# EAGLE design galvanika-board-1.0 (EAGLE 9.4.2)
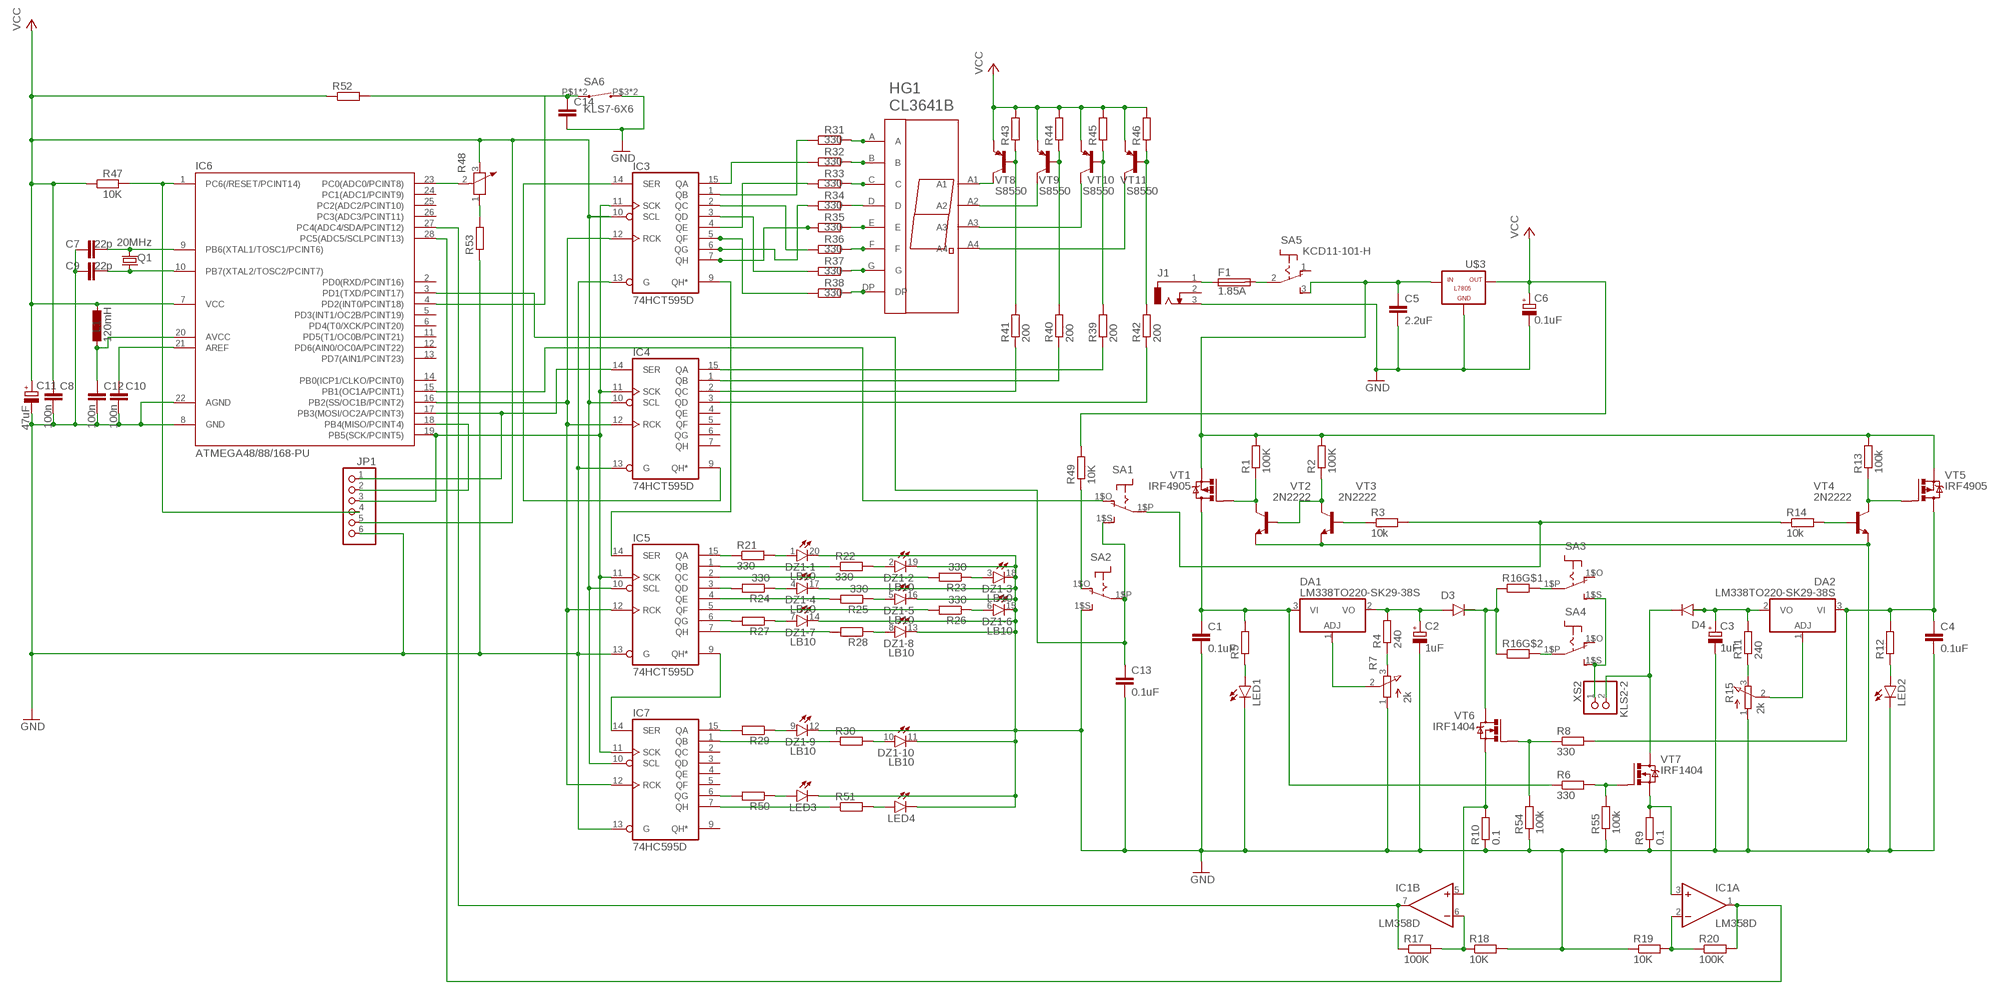
[diagram p0: schematic, sheet 1]

## Parts
C1  0.1uF  C-EUC1206  [C1206]
C2  1uF  CPOL-EUE5-4  [E5-4]
C3  1uF  CPOL-EUE5-4  [E5-4]
C4  0.1uF  C-EUC1206  [C1206]
C5  2.2uF  C-EU025-025X050  [C025-025X050]
C6  0.1uF  CPOL-EUE2.5-5  [E2,5-5]
C7  22p  C-EU025-025X050  [C025-025X050]
C8  100n  C-EU025-025X050  [C025-025X050]
C9  22p  C-EU025-025X050  [C025-025X050]
C10  100n  C-EU025-025X050  [C025-025X050]
C11  47uF  CPOL-EUE2-4  [E2-4]
C12  100n  C-EU025-025X050  [C025-025X050]
C13  0.1uF  C-EUC1206  [C1206]
C14  C-EUC1206  [C1206]
D3  1N4001  [DO41-10]
D4  1N4001  [DO41-10]
DA1  LM338TO220-SK29-38S  [TO220-SK29-38S]
DA2  LM338TO220-SK29-38S  [TO220-SK29-38S]
DZ1  LB10  [LB10]
F1  1.85A  MF-R  [MF-R]
HG1  CL3641B  [CL3641B]
IC1  LM358D  [SO08]
IC3  74HCT595D  [SO16]
IC4  74HCT595D  [SO16]
IC5  74HCT595D  [SO16]
IC6  ATMEGA48/88/168-PU  [DIL28-3]
IC7  74HC595D  [SO16]
J1  DCJ0303  [DCJ0303]
JP1  PINHD-1X6  [1X06]
L1  120mH  L-EU0207/10  [0207/10]
LED1  LED3MM  [LED3MM]
LED2  LED3MM  [LED3MM]
LED3  LED3MM  [LED3MM]
LED4  LED3MM  [LED3MM]
Q1  20MHz  CRYSTALHC49S  [HC49/S]
R1  100K  R-EU_0207/10  [0207/10]
R2  100K  R-EU_0207/10  [0207/10]
R3  10k  R-EU_0207/10  [0207/10]
R4  240  R-EU_0207/10  [0207/10]
R5  R-EU_0207/10  [0207/10]
R6  330  R-EU_0207/10  [0207/10]
R7  2k  3RP/1610N  [3RP/1610N]
R8  330  R-EU_0207/10  [0207/10]
R9  0.1  R-EU_0411/12  [0411/12]
R10  0.1  R-EU_0411/12  [0411/12]
R11  240  R-EU_0207/10  [0207/10]
R12  R-EU_0207/10  [0207/10]
R13  100k  R-EU_0207/10  [0207/10]
R14  10k  R-EU_0207/10  [0207/10]
R15  2k  3RP/1610N  [3RP/1610N]
R16  SQP-5W-2  [SQP-5W-2]
R17  100K  R-EU_R1206  [R1206]
R18  10K  R-EU_R1206  [R1206]
R19  10K  R-EU_R1206  [R1206]
R20  100K  R-EU_R1206  [R1206]
R21  330  R-EU_R1206  [R1206]
R22  330  R-EU_R1206  [R1206]
R23  330  R-EU_R1206  [R1206]
R24  330  R-EU_R1206  [R1206]
R25  330  R-EU_R1206  [R1206]
R26  330  R-EU_R1206  [R1206]
R27  R-EU_R1206  [R1206]
R28  R-EU_R1206  [R1206]
R29  R-EU_R1206  [R1206]
R30  R-EU_R1206  [R1206]
R31  330  R-EU_R1206  [R1206]
R32  330  R-EU_R1206  [R1206]
R33  330  R-EU_R1206  [R1206]
R34  330  R-EU_R1206  [R1206]
R35  330  R-EU_R1206  [R1206]
R36  330  R-EU_R1206  [R1206]
R37  330  R-EU_R1206  [R1206]
R38  330  R-EU_R1206  [R1206]
R39  200  R-EU_R1206  [R1206]
R40  200  R-EU_R1206  [R1206]
R41  200  R-EU_R1206  [R1206]
R42  200  R-EU_R1206  [R1206]
R43  R-EU_R1206  [R1206]
R44  R-EU_R1206  [R1206]
R45  R-EU_R1206  [R1206]
R46  R-EU_R1206  [R1206]
R47  10K  R-EU_0207/10  [0207/10]
R48  R0904N  [R0904N]
R49  10K  R-EU_0207/10  [0207/10]
R50  R-EU_R1206  [R1206]
R51  R-EU_R1206  [R1206]
R52  R-EU_R1206  [R1206]
R53  R-EU_R1206  [R1206]
R54  100k  R-EU_R1206  [R1206]
R55  100k  R-EU_R1206  [R1206]
SA1  SS12D00DIP  [SS12D00]
SA2  SS12D00DIP  [SS12D00]
SA3  SS12D00DIP  [SS12D00]
SA4  SS12D00DIP  [SS12D00]
SA5  KCD11-101-H  [KCD11-101-H]
SA6  KLS7-6X6  [KLS7-6X6]
U$3  L7805  [TO220-SK29-38S]
VT1  IRF4905  [TO220-V]
VT2  2N2222  [TO92]
VT3  2N2222  [TO92]
VT4  2N2222  [TO92]
VT5  IRF4905  [TO220-V]
VT6  IRF1404  [TO220-V]
VT7  IRF1404  [TO220-V]
VT8  S8550  [TO92]
VT9  S8550  [TO92]
VT10  S8550  [TO92]
VT11  S8550  [TO92]
XS2  KLS2-2  [KLS2-2]

## Nets
+19V: C5.1 R1.2 R2.2 R13.2 SA5.3(S) U$3.1(IN) VT1.S VT5.S
A-LEFT: IC1.3(A:+IN) R9.2 VT7.S
A-RIGHT: IC1.5(B:+IN) R10.2 VT6.S
BRANCH-CTRL: R3.2 R14.1 SA1.1$P(P)
CLOCK: IC3.11(SCK) IC4.11(SCK) IC5.11(SCK) IC6.19(PB5(SCK/PCINT5)) IC7.11(SCK) JP1.3
DATA: IC3.14(SER) IC4.9(QH*)
GND: C1.2 C2.- C3.- C4.2 C5.2 C6.- C7.1 C8.2 C9.1 C10.2 C11.- C12.2 C13.2 C14.2 DZ1.11(-10:C) DZ1.12(-9:C) DZ1.13(-8:C) DZ1.14(-7:C) DZ1.15(-6:C) DZ1.16(-5:C) DZ1.17(-4:C) DZ1.18(-3:C) DZ1.19(-2:C) DZ1.20(-1:C) IC3.13(G) IC4.13(G) IC5.13(G) IC6.8(GND) IC6.22(AGND) IC7.13(G) J1.3 JP1.6 LED1.K(C) LED2.K(C) LED3.K(C) LED4.K(C) R7.1(A) R9.1 R10.1 R15.1(A) R18.2 R19.1 R53.1 R54.1 R55.1 SA2.1$S(S) SA6.P$3 SA6.P$4 U$3.2(GND) VT2.3(E) VT3.3(E) VT4.3(E)
LATCH: IC3.12(RCK) IC4.12(RCK) IC5.12(RCK) IC6.16(PB2(SS/OC1B/PCINT2)) IC7.12(RCK)
MISO: IC6.18(PB4(MISO/PCINT4)) JP1.2
MOSI: IC4.14(SER) IC6.17(PB3(MOSI/OC2A/PCINT3)) JP1.1
N$1: R1.1 VT1.G VT2.1(C)
N$2: R2.1 VT2.2(B) VT3.1(C)
N$3: R16.4 SA4.1$P(P)
N$4: IC5.15(QA) R21.1
N$5: HG1.D R34.2
N$6: R3.1 VT3.2(B)
N$7: IC3.4(QE) R33.1
N$8: LED1.A R5.1
N$9: R4.1 R7.3(E)
N$10: DA1.1(ADJ) R7.2(S)
N$11: IC1.7(B:OUT) IC6.27(PC4(ADC4/SDA/PCINT12)) R17.1
N$12: R8.1 R54.2 VT6.G
N$13: D3.C(CATHODE) R16.1 R16.3 VT6.D
N$14: R16.2 SA3.1$P(P)
N$15: R6.2 R55.2 VT7.G
N$16: IC3.1(QB) R31.1
N$17: IC3.7(QH) R35.1
N$18: DZ1.1(-1:A) R21.2
N$19: LED2.A R12.1
N$20: R13.1 VT4.1(C) VT5.G
N$21: R11.1 R15.3(E)
N$22: R14.2 VT4.2(B)
N$23: DA2.1(ADJ) R15.2(S)
N$25: IC7.6(QG) R50.2
N$26: IC1.6(B:-IN) R17.2 R18.1
N$27: IC1.2(A:-IN) R19.2 R20.1
N$28: IC1.1(A:OUT) IC6.28(PC5(ADC5/SCLPCINT13)) R20.2
N$29: IC5.1(QB) R22.1
N$30: DZ1.2(-2:A) R22.2
N$31: IC5.2(QC) R23.2
N$32: DZ1.3(-3:A) R23.1
N$33: DZ1.4(-4:A) R24.1
N$34: IC5.3(QD) R24.2
N$35: IC3.5(QF) R38.1
N$36: IC5.4(QE) R25.2
N$37: DZ1.5(-5:A) R25.1
N$38: IC5.5(QF) R26.2
N$39: DZ1.6(-6:A) R26.1
N$40: IC5.6(QG) R27.2
N$41: DZ1.7(-7:A) R27.1
N$42: IC5.7(QH) R28.2
N$43: DZ1.8(-8:A) R28.1
N$44: IC3.2(QC) R36.1
N$45: IC3.9(QH*) IC5.14(SER)
N$46: IC7.7(QH) R51.1
N$47: IC5.9(QH*) IC7.14(SER)
N$48: IC7.15(QA) R29.2
N$49: IC7.1(QB) R30.1
N$50: DZ1.10(-10:A) R30.2
N$51: DZ1.9(-9:A) R29.1
N$52: HG1.A R31.2
N$53: HG1.B R32.2
N$54: HG1.C R33.2
N$55: LED3.A R50.1
N$56: HG1.E R35.2
N$57: HG1.F R36.2
N$58: HG1.G R37.2
N$59: HG1.DP R38.2
N$60: D4.C(CATHODE) VT7.D XS2.2
N$61: IC3.15(QA) R32.1
N$62: F1.1 J1.1
N$63: SA3.1$S(S) SA4.1$S(S) XS2.1
N$64: IC3.3(QD) R37.1
N$65: F1.2 SA5.2(P)
N$67: IC3.6(QG) R34.1
N$68: LED4.A R51.2
N$69: IC4.15(QA) R39.1
N$70: IC4.1(QB) R40.1
N$71: IC4.2(QC) R41.1
N$72: IC4.3(QD) R42.1
N$73: R41.2 R43.1 VT8.2(B)
N$74: R40.2 R44.1 VT9.2(B)
N$75: R39.2 R45.1 VT10.2(B)
N$76: R42.2 R46.1 VT11.2(B)
N$77: HG1.A1 VT8.1(C)
N$78: HG1.A2 VT9.1(C)
N$79: HG1.A3 VT10.1(C)
N$80: HG1.A4 VT11.1(C)
N$81: C7.2 IC6.9(PB6(XTAL1/TOSC1/PCINT6)) Q1.2
N$82: C9.2 IC6.10(PB7(XTAL2/TOSC2/PCINT7)) Q1.1
N$83: C10.1 IC6.21(AREF)
N$84: C12.1 IC6.20(AVCC) L1.2
N$85: IC6.1(PC6(/RESET/PCINT14)) JP1.4 R47.2
N$86: C14.1 IC6.4(PD2(INT0/PCINT18)) R52.2 SA6.P$1 SA6.P$2
N$87: R48.1 R53.2
N$88: IC6.23(PC0(ADC0/PCINT8)) R48.2
PWM: IC6.15(PB1(OC1A/PCINT1)) SA1.1$O(O)
PWM-CTRL: C13.1 IC6.3(PD1(TXD/PCINT17)) SA1.1$S(S) SA2.1$P(P)
RIGHT-EN: R49.1 SA2.1$O(O)
VCC: C6.+ C8.1 C11.+ IC3.10(SCL) IC4.10(SCL) IC5.10(SCL) IC6.7(VCC) IC7.10(SCL) JP1.5 L1.1 R43.2 R44.2 R45.2 R46.2 R47.1 R48.3 R49.2 R52.1 U$3.3(OUT) VT8.3(E) VT9.3(E) VT10.3(E) VT11.3(E)
VI-LEFT: C1.1 DA1.3(VI) R5.2 R6.1 VT1.D
VI-RIGHT: C4.1 DA2.3(VI) R8.2 R12.2 VT5.D
VO-LEFT: C2.+ D3.A(ANODE) DA1.2(VO) R4.2
VO-RIGHT: C3.+ D4.A(ANODE) DA2.2(VO) R11.2
Unconnected: IC4.4(QE) IC4.5(QF) IC4.6(QG) IC4.7(QH) IC6.2(PD0(RXD/PCINT16)) IC6.5(PD3(INT1/OC2B/PCINT19)) IC6.6(PD4(T0/XCK/PCINT20)) IC6.11(PD5(T1/OC0B/PCINT21)) IC6.12(PD6(AIN0/OC0A/PCINT22)) IC6.13(PD7(AIN1/PCINT23)) IC6.14(PB0(ICP1/CLKO/PCINT0)) IC6.24(PC1(ADC1/PCINT9)) IC6.25(PC2(ADC2/PCINT10)) IC6.26(PC3(ADC3/PCINT11)) IC7.2(QC) IC7.3(QD) IC7.4(QE) IC7.5(QF) IC7.9(QH*) J1.2 SA3.1$O(O) SA4.1$O(O) SA5.1(O)

## Power pins joined to a net without a drawn wire
GND: IC1.4(P:V-) IC3.8(GND) IC4.8(GND) IC5.8(GND) IC7.8(GND)
VCC: IC1.8(P:V+) IC3.16(VCC) IC4.16(VCC) IC5.16(VCC) IC7.16(VCC)

## Library data of the parts
C1 C4 C5 C7-C10 C12-C14 = rcl:C-EU: CAPACITOR, European symbol; SPICEPREFIX: C
C2 C3 C6 C11 = rcl:CPOL-EU: POLARIZED CAPACITOR, European symbol; SPICEPREFIX: C
D3 D4 = tango:1N4001: DIODE general purpose rectifier, 1 A
DA1 DA2 = dragberry:LM338
DZ1 = led:LB10: LED BLOCK 10-LED bar graph, DIL, Siemens
F1 = dragberry:MF-R
HG1 = dragberry:CL3641B
IC1 = linear:LM358: OP AMP also LM158; LM258; LM2904 Source: http://cache.national.com/ds/LM/LM158.pdf
IC3-IC5 IC7 = 74xx-eu:74*595: 8-bit SHIFT REGISTER, output latch
IC6 = atmega8:ATMEGA48/88/168-PU
J1 = con-jack:DCJ0303: DC POWER JACK Source: DCJ0303.pdf; OC_FARNELL: unknown; OC_NEWARK: unknown
JP1 = pinhead:PINHD-1X6: PIN HEADER
L1 = rcl:L-EU: INDUCTOR, European symbol; SPICEPREFIX: L
LED1-LED4 = led:LED: LED OSRAM: - CHIPLED LG R971, LG N971, LY N971, LG Q971, LY Q971, LO R971, LY R971 LH N974, LH R974 LS Q976, LO Q976, LY Q976 LO Q996 - Hyper CHIPLED LW Q18S LB Q993, LB Q99A, LB R99A - SideLED LS A670, LO A670, LY A670, LG A670, LP A670 LB A673, LV A673, LT A673, LW A673 LH A674 LY A675 LS A676, LA A676, LO A676, LY A676, LW A676 LS A679, LY A679, LG A679 - Hyper Micro SIDELED® LS Y876, LA Y876, LO Y876, LY Y876 LT Y87S - SmartLED LW L88C, LW L88S LB L89C, LB L89S, LG L890 LS L89K, LO L89K, LY L89K LS L896, LA L896, LO L896, LY L896 - TOPLED LS T670, LO T670, LY T670, LG T670, LP T670 LSG T670, LSP T670, LSY T670, LOP T670, LYG T670 LG T671, LOG T671, LSG T671 LB T673, LV T673, LT T673, LW T673 LH T674 LS T676, LA T676, LO T676, LY T676, LB T676, LH T676, LSB T676, LW T676 LB T67C, LV T67C, LT T67C, LS T67K, LO T67K, LY T67K, LW E67C LS E67B, LA E67B, LO E67B, LY E67B, LB E67C, LV E67C, LT E67C LW T67C LS T679, LY T679, LG T679 LS T770, LO T770, LY T770, LG T770, LP T770 LB T773, LV T773, LT T773, LW T773 LH T774 LS E675, LA E675, LY E675, LS T675 LS T776, LA T776, LO T776, LY T776, LB T776 LHGB T686 LT T68C, LB T68C - Hyper Mini TOPLED® LB M676 - Mini TOPLED Santana® LG M470 LS M47K, LO M47K, LY M47K Source: http://www.osram.convergy.de LUXEON: - LUMILED® LXK2-PW12-R00, LXK2-PW12-S00, LXK2-PW14-U00, LXK2-PW14-V00 LXK2-PM12-R00, LXK2-PM12-S00, LXK2-PM14-U00 LXK2-PE12-Q00, LXK2-PE12-R00, LXK2-PE12-S00, LXK2-PE14-T00, LXK2-PE14-U00 LXK2-PB12-K00, LXK2-PB12-L00, LXK2-PB12-M00, LXK2-PB14-N00, LXK2-PB14-P00, LXK2-PB14-Q00 LXK2-PR12-L00, LXK2-PR12-M00, LXK2-PR14-Q00, LXK2-PR14-R00 LXK2-PD12-Q00, LXK2-PD12-R00, LXK2-PD12-S00 LXK2-PH12-R00, LXK2-PH12-S00 LXK2-PL12-P00, LXK2-PL12-Q00, LXK2-PL12-R00 Source: www.luxeon.com KINGBRIGHT: KA-3528ASYC Source: www.kingbright.com
Q1 = crystal:CRYSTAL: CRYSTAL; OC_FARNELL: 1667008; OC_NEWARK: unknown
R1-R6 R8-R14 R17-R47 R49-R55 = rcl:R-EU_: RESISTOR, European symbol; SPICEPREFIX: R
R7 R15 = pot:3RP/1610N: 16mm Potentiometer one level Source: http://www.alphapotentiometers.net/html/16mm_pot_2.html
R16 = dragberry:SQP-5W-2
R48 = dragberry:R0904N
SA1-SA4 = dragberry:SS12D00
SA5 = dragberry:KCD11-101-H
SA6 = dragberry:KLS7-6X6
U$3 = dragberry:L7805
VT1 VT5 = dragberry:IRF4905: P-Channel HEXFET® Power MOSFET RDS(on)= 0.02 Ohm, ID = -74A Source: http://www.irf.com/product-info/datasheets/data/irf4905pbf.pdf
VT2-VT4 = dragberry:2N2222
VT6 VT7 = dragberry:IRF1404
VT8-VT11 = dragberry:S8550
XS2 = dragberry:KLS2-2

## Board
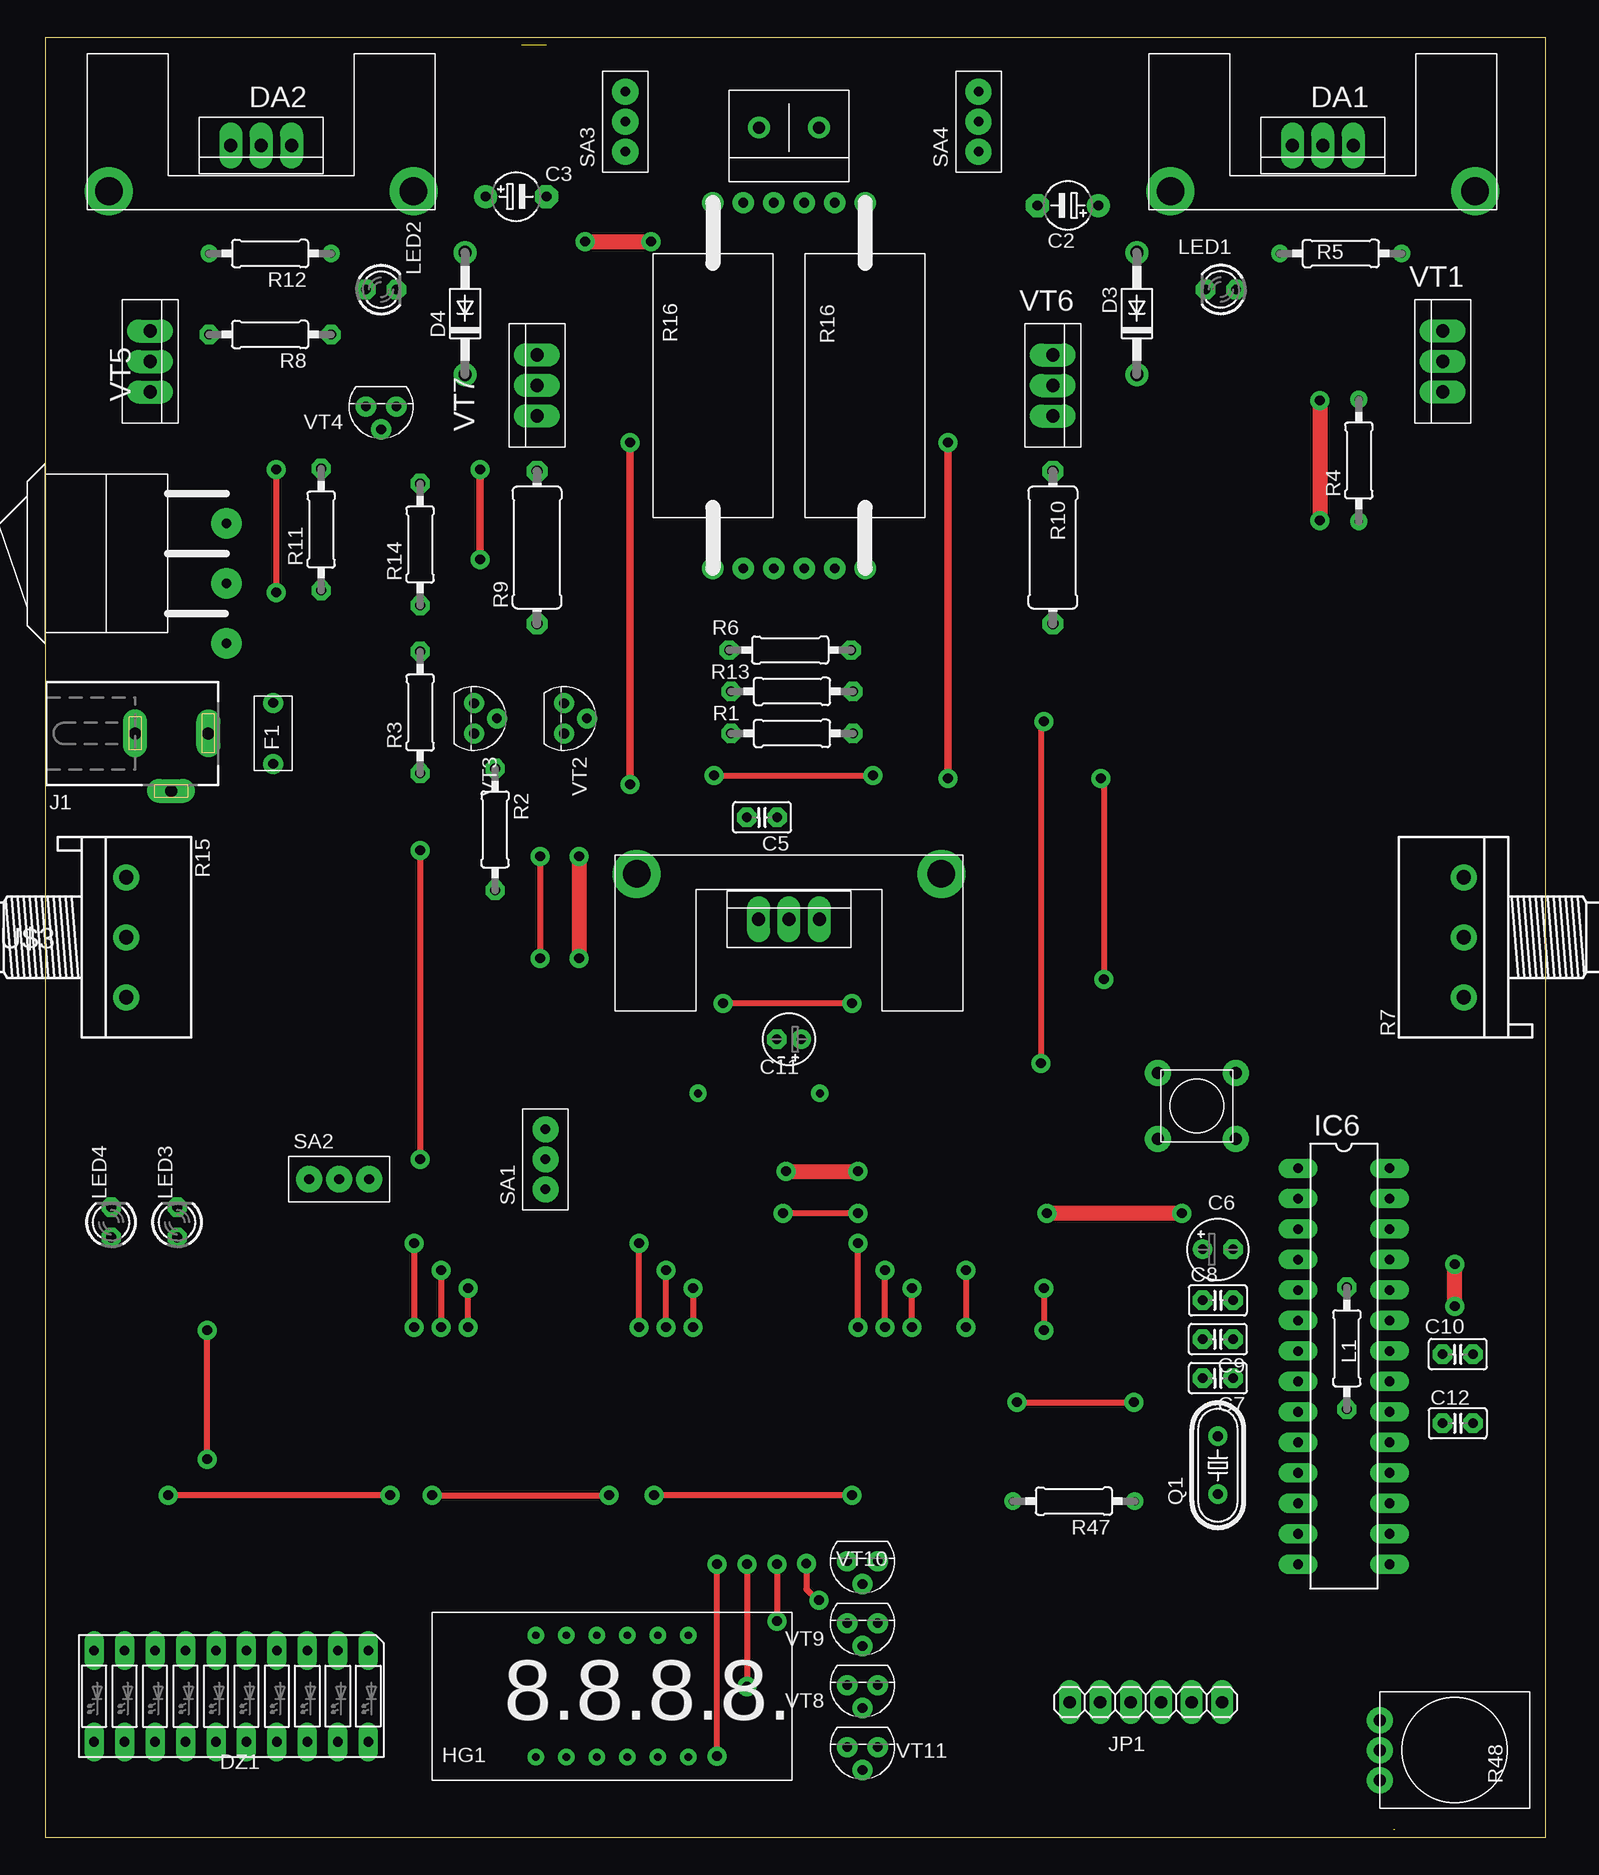
[diagram p1: board, top side]
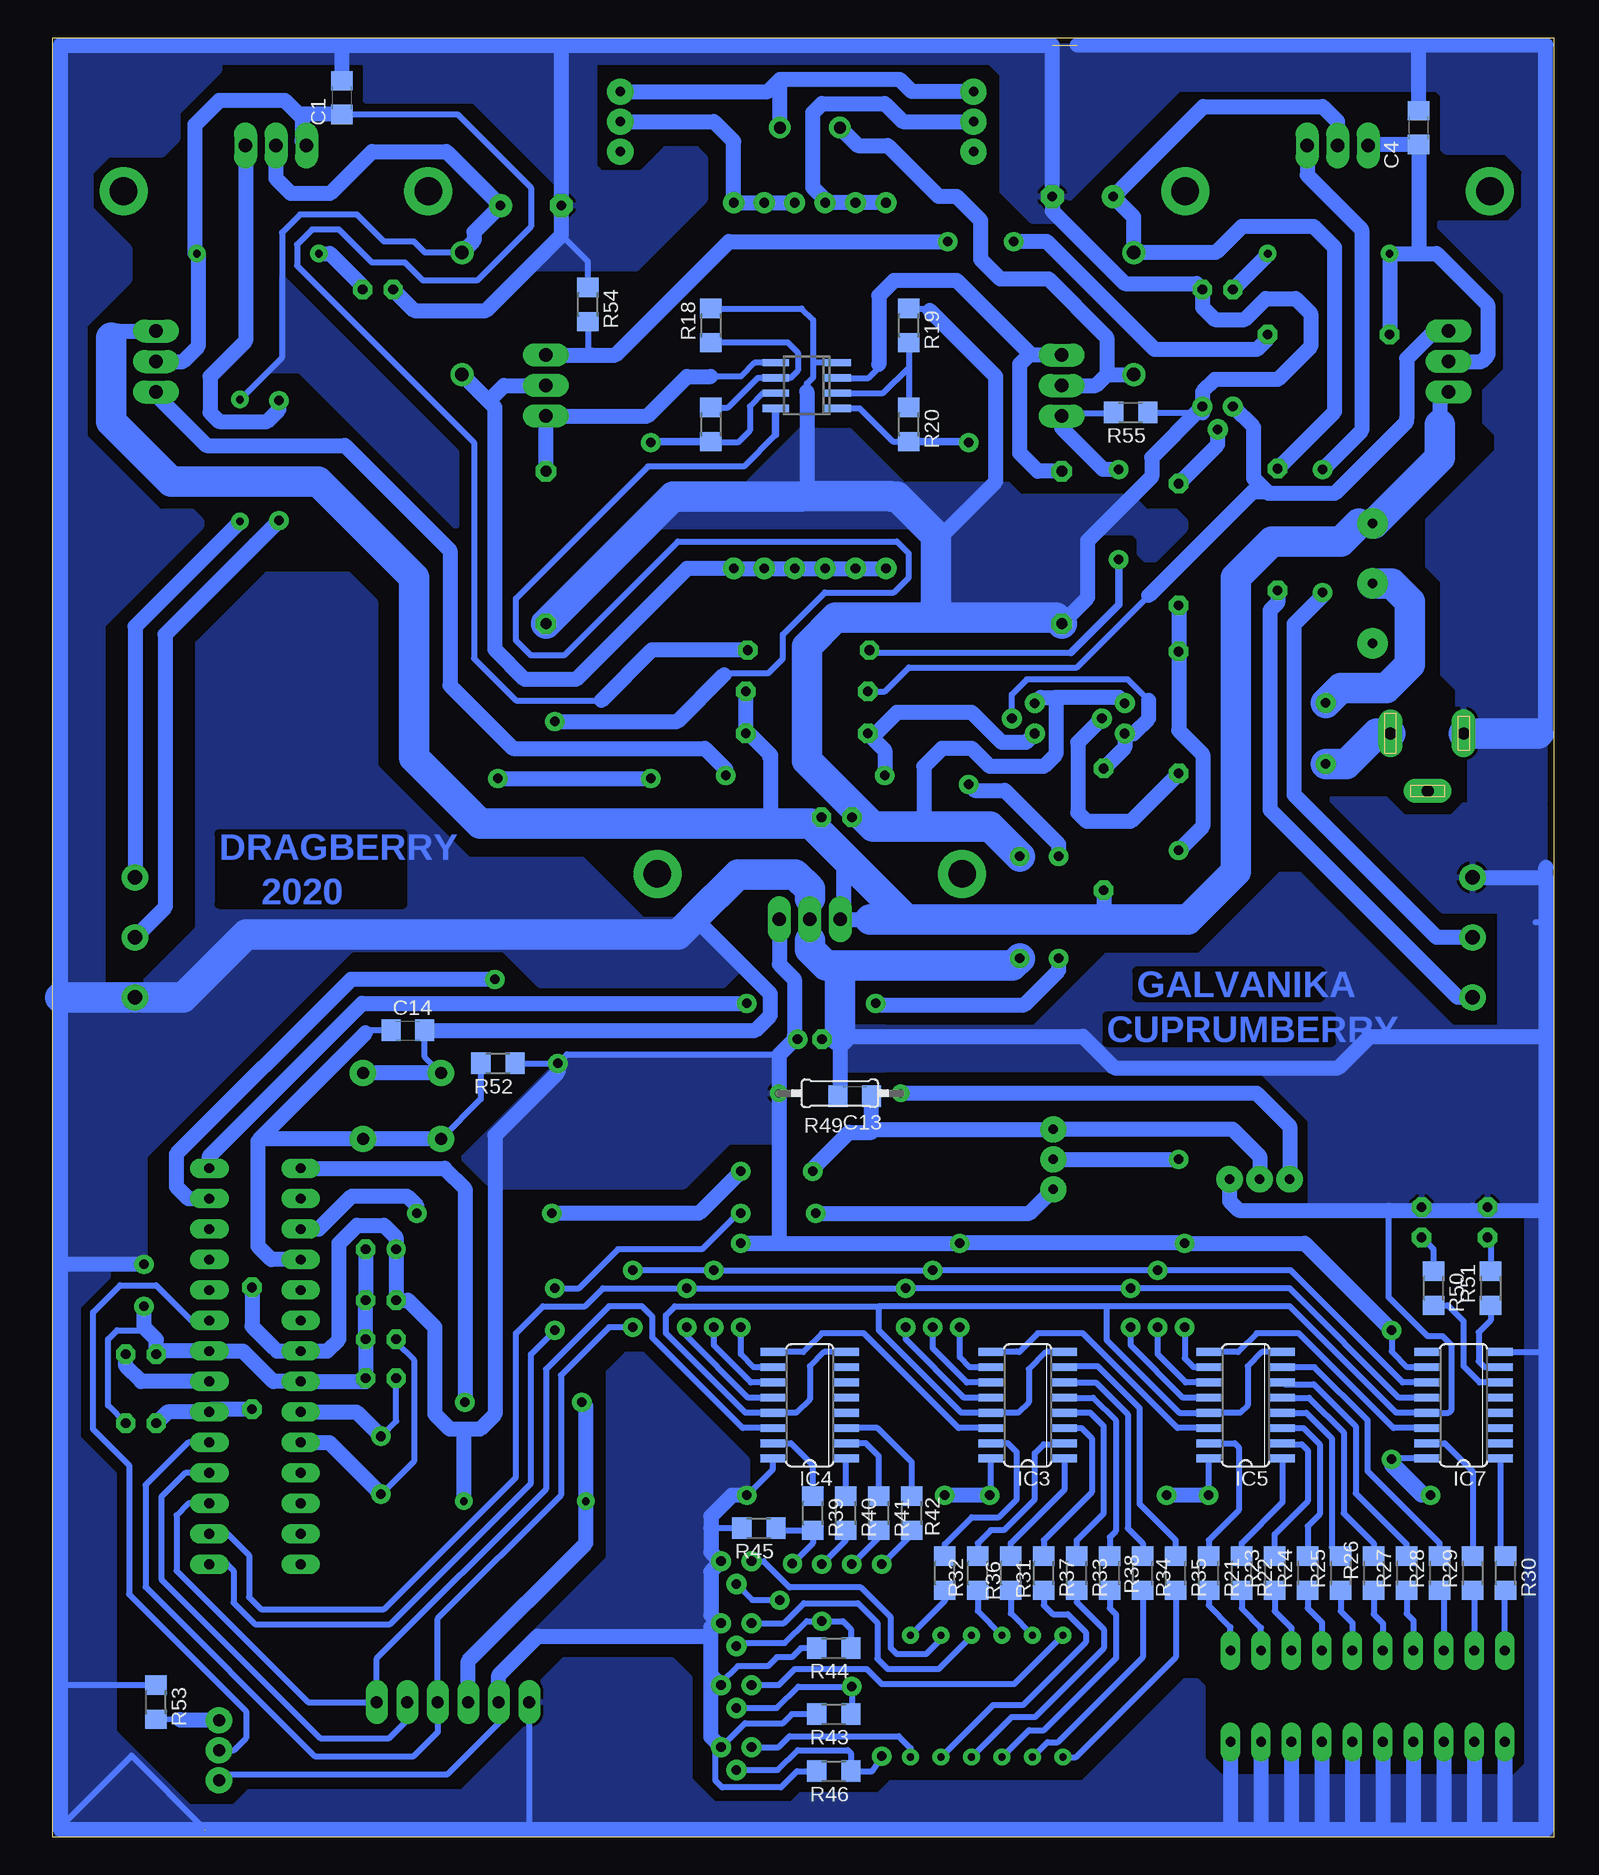
[diagram p2: board, bottom side, seen from below]

Size 125.1 x 150 mm. Coordinates in mm from the lower left corner, seen from the top.
Outline: 0,0 125.1,0 125.1,150 0,150 0,0
Copper layers (1*16): Top 0.035mm / dielectric 1.5mm / Bottom 0.035mm
Design rules "default *": minimum track width 6mil, minimum drill 0.6mm, track to track 15mil, track to pad 6mil, pad to pad 6mil, via to via 6mil, smd to smd 6mil, copper to edge 0mil, drill to drill 6mil, minimum pad ring 0.4mm, minimum via ring 8mil, stop-mask expansion 4mil, vias tented up to drill 0mil, thermal gap 10mil

### Footprints (pad centres in the part's own frame; a part is rotated, then mirrored left to right if it is on the bottom)
C1206 = smd 1.6 x 1.8: 1 -1.4,0; 2 1.4,0
E5-4 = drill 0.813 pad 1.905: + -2.54,0 | drill 0.813 pad 1.905 octagon: - 2.54,0
C025-025X050 = drill 0.813 octagon: 1 -1.27,0; 2 1.27,0
E2,5-5 = drill 0.813 pad 1.6: + -1.27,0 | drill 0.813 pad 1.6 octagon: - 1.27,0
E2-4 = drill 0.813 pad 1.27: + -1.016,0 | drill 0.813 pad 1.27 octagon: - 1.016,0
DO41-10 = drill 1.118: A 5.08,0; C -5.08,0
TO220-SK29-38S = drill 1.118 long: 1 -2.54,0; 2 0,0; 3 2.54,0 | drill 2.3 pad 4: R$1 -12.7,3.8; R$2 12.7,3.8
LB10 = drill 0.813 long: 1 -11.43,-3.81; 2 -8.89,-3.81; 3 -6.35,-3.81; 4 -3.81,-3.81; 5 -1.27,-3.81; 6 1.27,-3.81; 7 3.81,-3.81; 8 6.35,-3.81; 9 8.89,-3.81; 10 11.43,-3.81; 11 11.43,3.81; 12 8.89,3.81; 13 6.35,3.81; 14 3.81,3.81; 15 1.27,3.81; 16 -1.27,3.81; 17 -3.81,3.81; 18 -6.35,3.81; 19 -8.89,3.81; 20 -11.43,3.81
MF-R = drill 0.8 pad 1.676: 1 -2.54,0; 2 2.54,0
CL3641B = drill 0.6 pad 1.27: A -3.81,5.08; A1 -6.35,5.08; A2 1.27,5.08; A3 3.81,5.08; A4 6.35,-5.08; B 6.35,5.08; C 1.27,-5.08; D -3.81,-5.08; DP -1.27,-5.08; E -6.35,-5.08; F -1.27,5.08; G 3.81,-5.08
SO08 = smd 0.6 x 2.2: 1 -1.905,-2.6; 2 -0.635,-2.6; 3 0.635,-2.6; 4 1.905,-2.6; 5 1.905,2.6; 6 0.635,2.6; 7 -0.635,2.6; 8 -1.905,2.6
SO16 = smd 0.66 x 2.032: 1 -4.445,-3.073; 2 -3.175,-3.073; 3 -1.905,-3.073; 4 -0.635,-3.073; 5 0.635,-3.073; 6 1.905,-3.073; 7 3.175,-3.073; 8 4.445,-3.073; 9 4.445,3.073; 10 3.175,3.073; 11 1.905,3.073; 12 0.635,3.073; 13 -0.635,3.073; 14 -1.905,3.073; 15 -3.175,3.073; 16 -4.445,3.073
DIL28-3 = drill 0.813 long: 1 -16.51,-3.81; 2 -13.97,-3.81; 3 -11.43,-3.81; 4 -8.89,-3.81; 5 -6.35,-3.81; 6 -3.81,-3.81; 7 -1.27,-3.81; 8 1.27,-3.81; 9 3.81,-3.81; 10 6.35,-3.81; 11 8.89,-3.81; 12 11.43,-3.81; 13 13.97,-3.81; 14 16.51,-3.81; 15 16.51,3.81; 16 13.97,3.81; 17 11.43,3.81; 18 8.89,3.81; 19 6.35,3.81; 20 3.81,3.81; 21 1.27,3.81; 22 -1.27,3.81; 23 -3.81,3.81; 24 -6.35,3.81; 25 -8.89,3.81; 26 -11.43,3.81; 27 -13.97,3.81; 28 -16.51,3.81
DCJ0303 = drill 1 pad 2 long: 1 0,3.1; 2 4.8,0; 3 0,-3
1X06 = drill 1.016 long: 1 -6.35,0; 2 -3.81,0; 3 -1.27,0; 4 1.27,0; 5 3.81,0; 6 6.35,0
0207/10 = drill 0.813 octagon: 1 -5.08,0; 2 5.08,0
LED3MM = drill 0.813 octagon: A -1.27,0; K 1.27,0
HC49/S = drill 0.813: 1 -2.413,0; 2 2.413,0
0207/10' = drill 0.65 pad 1.27: 1 -5.08,0; 2 5.08,0
3RP/1610N = drill 1.2 pad 2.184: 1 -5,0; 2 0,0; 3 5,0
0411/12 = drill 0.914 octagon: 1 -6.35,0; 2 6.35,0
SQP-5W-2 = drill 0.8 pad 1.778: 1 -15.24,6.35; 2 15.24,6.35; 3 -15.24,-6.35; 4 15.24,-6.35; P$1 -15.24,3.81; P$2 -15.24,1.27; P$3 -15.24,-1.27; P$4 -15.24,-3.81; P$5 15.24,3.81; P$6 15.24,1.27; P$7 15.24,-1.27; P$8 15.24,-3.81
R1206 = smd 1.6 x 1.803: 1 -1.422,0; 2 1.422,0
R0904N = drill 1 pad 2.184: 1 -2.5,0; 2 0,0; 3 2.5,0
SS12D00 = drill 0.8 pad 2.184: 1$O -2.5,0; 1$P 0,0; 1$S 2.5,0
KCD11-101-H = drill 0.8 pad 2.54: 1 -7.5,-10; 2 -2.5,-10; 3 2.5,-10
KLS7-6X6 = drill 1 pad 2.184: P$1 -3.25,2.75; P$2 3.25,2.75; P$3 -3.25,-2.75; P$4 3.25,-2.75
TO220-V = drill 1.118 long: D 0,0; G -2.54,0; S 2.54,0
TO92 = drill 0.813 pad 1.676: 1 1.27,0; 2 0,1.905; 3 -1.27,0
KLS2-2 = drill 1 pad 1.778: 1 -2.5,0; 2 2.5,0

### Placement (x,y rotation side)
C1  101,145 90 bottom
C2  85.25,136 180 top
C3  39.25,136.75 0 top
C4  11.25,142.5 90 bottom
C5  59.75,85 180 top
C6  97.75,49 0 top
C7  97.75,38.25 180 top
C8  97.75,44.75 0 top
C9  97.75,41.5 180 top
C10  117.75,40.25 180 top
C11  62,66.5 180 top
C12  117.75,34.5 0 top
C13  58.25,61.75 180 bottom
C14  95.5,67.25 0 bottom
D3  91,127 90 top
D4  35,127 90 top
DA1  106.5,141 180 top
DA2  18,141 180 top
DZ1  15.5,11.75 180 top
F1  19,92 90 top
HG1  47.25,11.75 0 top
IC1  62.25,121 90 bottom
IC3  43.83,36 90 bottom
IC4  62,36 90 bottom
IC5  25.67,36 90 bottom
IC6  108.25,39.25 270 top
IC7  7.5,36 90 bottom
J1  10.5,92 270 top
JP1  91.75,11.25 180 top
L1  108.5,40.75 270 top
LED1  98,129 180 top
LED2  28,129 0 top
LED3  11,51.25 90 top
LED4  5.5,51.25 90 top
Q1  97.75,31 90 top
R1  62.25,92 0 top
R2  37.5,84 270 top
R3  31.25,93.75 90 top
R4  240  [0207/10']  109.5,114.75 90 top
R5  [0207/10']  108,132 0 top
R6  62.1,98.95 180 top
R7  118.25,75 90 top
R8  18.75,125.25 180 top
R9  41,107.5 90 top
R10  84,107.5 90 top
R11  23,109 90 top
R12  [0207/10']  18.75,132 180 top
R13  62.25,95.5 0 top
R14  31.25,107.75 90 top
R15  6.75,75 270 top
R16  62,121 90 top
R17  70.25,117.75 90 bottom
R18  70.25,126 90 bottom
R19  53.75,126 270 bottom
R20  53.75,117.75 270 bottom
R21  28.75,22 270 bottom
R22  26,22 270 bottom
R23  23.25,22 90 bottom
R24  20.5,22 90 bottom
R25  17.75,22 90 bottom
R26  15,22 90 bottom
R27  12.25,22 90 bottom
R28  9.5,22 90 bottom
R29  6.75,22 90 bottom
R30  4,22 270 bottom
R31  45.25,22 270 bottom
R32  50.75,22 270 bottom
R33  39.75,22 270 bottom
R34  34.25,22 270 bottom
R35  31.5,22 270 bottom
R36  48,22 270 bottom
R37  42.5,22 270 bottom
R38  37,22 270 bottom
R39  61.75,27 270 bottom
R40  59,27 270 bottom
R41  56.25,27 270 bottom
R42  53.5,27 270 bottom
R43  60,10.25 180 bottom
R44  60,15.75 180 bottom
R45  66.25,25.75 180 bottom
R46  60,5.5 180 bottom
R47  10K  [0207/10']  85.75,28 180 top
R48  111.25,7.25 270 top
R49  10K  [0207/10']  59.5,62 180 bottom
R50  10,45.75 270 bottom
R51  5.25,45.75 90 bottom
R52  88,64.5 180 bottom
R53  116.5,11.25 270 bottom
R54  80.5,127.75 270 bottom
R55  35.25,118.75 180 bottom
SA1  41.7,56.5 90 top
SA2  24.5,54.85 0 top
SA3  48.35,143 90 top
SA4  77.8,143 90 top
SA5  5.1,107 90 top
SA6  96,60.95 180 top
U$3  62,76.5 0 top
VT1  116.5,123 90 top
VT2  43.25,93.25 270 top
VT3  35.75,93.25 270 top
VT4  28,119.25 180 top
VT5  8.75,123 270 top
VT6  84,121 270 top
VT7  41,121 90 top
VT8  68.12,12.67 180 top
VT9  68.12,17.83 180 top
VT10  68.12,23 180 top
VT11  68.12,7.5 180 top
XS2  62,142.5 180 top

### Tracks (layer width: path | path; a pad name or v marks a point on that pad's centre or on a via)
+19V
  Bottom 0.508: R13.2 67.33,95.25 67.33,92.25 R1.2 65.33,90 | 37.5,77.25 37.5,76.5
  Bottom 0.61: C5.1 61.46,85 61.96,84.5
  Bottom 1.27: 16.25,109.5 SA5.3 | VT5.S 9.5,119.71 9.5,117.75 | 59.21,81.75 59.21,76.75 U$3.1 57,76.5 | VT1.S 119.71,125.54 120.25,125 | 65.25,84.5 65.25,89.92 | 65.33,90 65.25,89.92 | 65.25,89.92 65.25,90.17 67.33,92.25 | R1.2 67.33,95.25 | R2.2 37.5,77.25
  Bottom 2.54: 57,76.5 53.96,76.5 | 16.25,109.5 17.75,108 23.5,108 26.5,105 26.5,80.5 30.5,76.5 37.5,76.5 53.96,76.5 | 53.96,76.5 59.21,81.75 61.96,84.5 65.25,84.5 89.5,84.5 95,90 95,105 103,113 115.25,113 120.25,118 120.25,125 | 9.5,117.75 9.5,115 15,109.5 SA5.3
A-LEFT
  Bottom 0.508: IC1.3 57.12,121.64 56.25,122.5 56.25,122.75 | 49.75,129.75 43.88,123.88
  Bottom 1.27: R9.2 43,113.85 44.5,115.35 44.5,122.79 43.75,123.54 | VT7.S 43.75,123.54 | 43.75,123.54 43.75,123.75 49.75,129.75 55,129.75 56.25,128.5 56.25,122.75
A-RIGHT
  Bottom 0.508: IC1.5 66.59,122.91 67.75,121.75 70.25,121.75
  Bottom 1.27: R10.2 VT6.S 75.54,118.46 72.25,121.75 70.25,121.75
BRANCH-CTRL  (via drill 0.8 pad 1.6)
  Top 0.508: v31.25,82.25 v31.25,56.5
  Bottom 0.508: R14.1 R3.2 31.25,98.5 31.25,92.25
  Bottom 1.27: R14.1 31.25,98.5 | R3.2 31.25,92.25 29.25,90.25 29.25,84.25 v31.25,82.25 | SA1.1$P v31.25,56.5
CLOCK  (via drill 0.8 pad 1.6)
  Top 0.508: v33,47.25 v33,42.5 | v51.75,42.5 v51.75,47.25 | v70,42.5 v70,47.25 | v76.75,47.25 v76.75,42.5
  Bottom 0.508: IC7.11 12.57,37.91 21.92,47.25 v33,47.25 v51.75,47.25 v70,47.25 v76.75,47.25 | IC5.11 30.66,37.91 33,40.25 v33,42.5 33,42.75 | IC3.11 48.91,37.91 51.75,40.75 v51.75,42.5 | IC4.11 66.91,37.91 70,41 v70,42.5 | IC6.19 113.81,32.9 117.36,29.34 117.36,20.84 103.27,6.75 95.02,6.75 93.02,8.75 JP1.3 93.02,18.23 82.75,28.5 82.75,38.5 78.75,42.5 v76.75,42.5
DATA
  Bottom 0.508: IC3.14 49.59,34.09 57.5,42 61,42 62.55,40.45 IC4.9
GND  (via drill 0.8 pad 1.6)  (2 unrouted)
  Top 1.27: v44.5,81.75 v44.5,73.25 | v117.5,44.25 v117.5,47.75
  Bottom 0.508: R18.2 62.67,127.42 61.71,126.46 61.71,122.91 | IC1.4 61.71,122.91 | 62.25,111.78 62.25,120.5 62.25,121.17 61.71,121.71 61.71,122.91 | 62,111.78 62,111.75 | R19.1 52.17,127.42 | IC5.8 24.3,40.45 25.5,39.25 25.5,36 26.14,35.37 IC5.13 31.2,35.37 37.25,41.42 37.25,44.25 | IC7.8 0.64,40.45 | IC3.8 42.3,40.45 43.75,39 43.75,36.25 44.63,35.37 IC3.13 49.37,35.37 56.25,42.25 56.25,44.25 | 37.25,44.25 22,44.25 13.12,35.37 IC7.13 8.75,35.37 8.5,35.62 8.5,41 9.25,41.75 10.5,41.75 13.75,45 13.75,52.25 | 37.25,44.25 56.25,44.25 | IC4.8 60.8,40.45 62,39.25 62,36.5 63.13,35.37 IC4.13 67.36,35.37 74,42 74,43.5 73.25,44.25 56.25,44.25 | C7.1 99.02,37.98 | C12.2 120.5,35.98 120.5,41.5 119.75,42.25 117.25,42.25 116.21,41.21 116.21,40.52 | 112.39,0.64 118.54,6.79 124.5,0.83 124.5,12.67 R53.1 | JP1.6 85.4,1.03 85,0.64 | LED3.K 11.27,52.25 11.75,52.25 | LED4.K 5.77,52.25 6.75,52.25 | SA6.P$4 94.1,65.05 C14.2 | 71.65,76.6 65.29,70.25 | 0.64,76.25 1.5,76.25 | R54.1 80.5,131.33 82.71,133.54 | R55.1 33.12,118.75 33.1,118.73 29.27,118.73
  Bottom 0.61: 52,127.25 52.17,127.42 | 51.25,108.25 50.75,108.75 | C5.2 57.5,85 56.75,84.25
  Bottom 1.27: 0.64,80 0.64,76.25 0.64,66.75 | 0.64,66.75 0.64,52.25 | 0.64,52.25 0.64,40.45 0.64,0.64 4,0.64 | 4,0.64 6.5,0.64 | 6.5,0.64 9,0.64 | 9,0.64 11.69,0.64 | 14,0.64 16.77,0.64 | 16.77,0.64 19,0.64 | 19,0.64 21.75,0.64 | 21.75,0.64 24.25,0.64 | 24.25,0.64 26.75,0.64 | 26.75,0.64 85,0.64 112.39,0.64 | 112.5,0.64 124.47,0.64 124.47,47.75 | 0.64,80 0.64,80.84 | 11.5,149.37 0.64,149.37 0.64,91.75 0.89,92 1.27,92 | 11.5,149.37 39.7,149.37 | 101,149.37 124.47,149.37 124.47,70 124.47,47.75 | 101,149.37 82.71,149.37 C2.- 82.71,133.54 89,127.25 94.98,127.25 LED1.K | 86,149.37 41.79,149.37 C3.- 41.79,135.54 35.75,129.5 29.77,129.5 LED2.K 29.27,127.52 28.25,126.5 25.75,126.5 24,128.25 21.5,128.25 20.25,127 20.25,124.25 23,121.5 28.25,121.5 29.27,120.48 VT4.3 29.27,118.73 | 62,78.25 U$3.2 62,74.75 | C1.2 101,149.37 | 41,101.4 R9.1 38.83,103.33 38.83,108.08 33.5,113.4 33.5,115 29.52,118.98 | R15.1 0.64,80 | C4.2 11.25,149.12 11.5,149.37 | 51.25,101.65 59.85,101.65 | 51.25,105.9 51.25,108.25 54.75,111.75 62,111.75 62.75,111.75 62.25,112.25 62.25,120.5 | DZ1.11 4.07,0.7 4,0.64 | DZ1.12 6.61,0.74 6.5,0.64 | DZ1.13 9.15,0.79 9,0.64 | DZ1.14 11.69,0.64 | DZ1.15 14.23,0.86 14,0.64 | DZ1.16 16.77,0.64 | DZ1.17 19.31,0.94 19,0.64 | DZ1.18 21.85,0.73 21.75,0.64 | DZ1.19 24.39,0.78 24.25,0.64 | DZ1.20 26.93,0.81 26.75,0.64 | 0.64,52.25 6.75,52.25 11.75,52.25 13.75,52.25 26.25,52.25 27,53 SA2.1$S | 62,74 61.25,73.25 | 99.02,37.98 IC6.8 106.73,37.98 109.27,40.52 IC6.22 116.21,40.52 C10.2 116.48,41.48 117.25,42.25 117.5,42.5 v117.5,44.25 | 59.49,66.75 59.49,73.25 61.25,73.25 | 59.49,66.75 59.49,61.91 C13.2 | C6.- C8.2 C9.1 C7.1
  Bottom 1.27: C11.- 59.74,66.5 59.49,66.75 | v117.5,47.75 124.47,47.75 | 14,0.64 11.69,0.64 | 59.49,66.75 39.21,66.75 36.6,64.13 17.95,64.13 15.33,66.75 0.64,66.75 | 50.75,108.75 46.5,113 46.5,121.75 52,127.25 | SA6.P$4 SA6.P$3 | C14.2 66.54,67.25 65.29,68.5 65.29,70.25 65.29,70.29 72,77 72,76.96 71.65,76.6 | VT3.3 36.23,95 41.5,95 | 41.5,95 42.77,95 VT2.3 | 41.5,95 41.5,90.25 42.5,89.25 47,89.25 48.5,90.75 51,90.75 52.5,89.25 52.5,84.25 | 60.66,72.66 61.25,73.25
  Bottom 2.54: J1.3 1.27,92 | 124.47,70 R7.1 114.25,70 109,75.25 73,75.25 71.88,76.38 | 71.65,76.6 68,80.25 63.21,80.25 62,79.04 62,78.25 | v44.5,73.25 45.09,72.66 59.49,72.66 | 59.49,72.66 59.49,66.75 | v44.5,81.75 47,84.25 52.5,84.25 56.75,84.25 62.25,89.75 62.25,99.25 59.85,101.65 51.61,101.65 51.47,101.79 51.47,108.47 54.75,111.75 55.24,111.75 55.26,111.78 62,111.78 62.25,111.78 | 51.25,101.65 41.5,101.65 R9.1 | 62.75,111.75 73.4,111.75 R10.1 | 59.49,72.66 60.66,72.66 62,74 62,74.75
  pour Bottom: 0.75,52 20.25,52 20.25,59.75 24.5,64 57.75,64 57.75,65.5 55.75,67.5 43.25,67.5 37.25,73.5 29.5,73.5 22.75,80.25 21.25,80.25 8.5,67.5 0.75,67.5
  pour Bottom: 0.75,86 7.5,86 8.5,85 12.5,85 14,86.5 18.5,86.5 9.25,77.25 0.75,77.25
  pour Bottom: 0.75,149.25 125,149.25 123.75,148 47,148 46,147 46,137.25 43.5,134.75 41.5,134.75 41.5,135.5 31.25,145.75 9.75,145.75 9.25,145.25 9.25,140.75 9,140.5 4,140.5 2.25,138.75 0.75,138.75
  pour Bottom: 0.25,138.75 2.25,138.75 2.5,138.5 2.5,135.75 3.75,134.5 9.5,134.5 9.5,134.25 4,128.75 4,122.25 5.75,120.5 5.75,118 4.75,117 4.75,115.5 10.5,109.75 10.5,106 9.25,104.75 9.25,97 8,95.75 8,92.5 7,91.5 7,86.25 0.75,86.25 0.75,138.25
  pour Bottom: 0.25,67.5 2.25,67.5 2.25,6 3.25,5 27.75,5 29.25,6.5 29.25,12.5 29.75,13 30.75,13 39.25,4.5 55.25,4.5 58.5,1.25 58.5,0.25 0.25,0.25
  pour Bottom: 56.5,3.5 62.75,3.5 63.5,2.75 70,2.75 72,4.75 72,13.25 73.5,14.75 82.5,14.75 85.5,11.75 85.5,9.25 91.25,3.5 91.25,0.25 59.75,0.25
  pour Bottom: 91.25,3.75 108.75,3.75 110,2.5 113.75,2.5 120,8.75 120,30.25 123,33.25 123,44.25 120.5,46.75 120.5,47.75 124.75,47.75 124.75,0.25 91.25,0.25
  pour Bottom: 111.25,149.75 111.25,147.25 114.75,143.75 114.75,141.5 116,140.25 120.5,140.25 122,138.75 122,135.75 118.75,132.5 118.75,129.75 122.5,126 122.5,116.75 116.25,110.5 113.5,110.5 112.75,109.75 112.75,109.25 121,101 121,70 124.75,70 124.75,149.75
  pour Bottom: 117.5,47.75 124.75,47.75 124.75,70 118.75,70 113,75.75 113,99.5 107.25,105.25 100.5,105.25 98.25,103 98.25,89.25 90.5,81.5 81,81.5 76,76.5 71.75,76.5 67.75,72.5 69.25,71 84.5,71 87.5,74 100.25,74 117.5,56.75
  pour Bottom: 80,149.75 80,139.25 79.5,138.75 76,138.75 74,140.75 71.5,140.75 70.75,140 70.75,136.5 76.5,130.75 86,130.75 83,133.75 83,137.75 90,144.75 99,144.75 99,149.75
  pour Bottom: 55.75,67.5 59.75,67.5 59.75,64 55.75,64
  pour Bottom: 0.25,77.5 4.5,77.5 4.5,67.75 0.25,67.75
  pour Bottom: 40.75,101.5 51.5,101.5 51.5,108.5 54.5,111.5 54.5,112.5 54.25,112.75 46,112.75 45.5,112.75 44.75,112 44.5,111.75 35.25,111.75 34,110.5 32,110.5 31.5,110.5 30.75,109.75 30.75,109 31.25,108.5 33.25,106.5 34,106.5 34.5,107 34.5,108.25 35,108.75 38.25,108.75 38.75,108.25 38.75,108 39,107.75 39,103.25
  pour Bottom: 53.25,109.25 75.5,109.25 72,112.75 67.25,112.75 62.75,117.25 58.75,117.25 53.25,111.75
LATCH  (via drill 0.8 pad 1.6)
  Top 0.508: v35.25,42.5 v35.25,45.75 | v54,42.5 v54,45.75 | v72.25,42.5 v72.25,45.75
  Bottom 0.508: IC7.12 12.88,36.63 22,45.75 v35.25,45.75 v54,45.75 v72.25,45.75 79.25,45.75 80.75,44.25 84.25,44.25 86.5,42 86.5,30 97.5,19 107.75,19 108.75,20 108.75,23.5 110.5,25.25 112.03,25.25 IC6.16 | IC5.12 30.89,36.63 35.25,41 v35.25,42.5 35.25,42.75 | IC3.12 49.13,36.63 54,41.5 v54,42.5 | IC4.12 67.14,36.63 72.25,41.75 v72.25,42.5
MISO
  Bottom 0.508: IC6.18 114.06,30.36 116.06,28.36 116.06,21.5 102.81,8.25 97.06,8.25 95.56,9.75 JP1.2
MOSI
  Bottom 0.508: IC4.14 67.59,34.09 75.12,41.62 75.12,43.38 76,44.25 78.75,44.25 84,39 84,29 98.1,14.9 JP1.1 103.83,11.25 114.79,22.21 114.79,26.84 113.81,27.82 IC6.17
N$1  (via drill 0.8 pad 1.6)
  Top 0.508: v55.75,88.5 v69,88.5
  Bottom 0.508: R1.1 56.5,92
  Bottom 1.27: VT1.G 116.5,120.21 112.29,116 100.75,116 92,107.25 92,96 86.75,90.75 70.75,90.75 69,89 v69,88.5 | VT2.1 43.98,91.25 46,91.25 48.5,93.75 54.75,93.75 56.5,92 | R1.1 55.75,90.58 v55.75,88.5
N$2
  Bottom 0.508: 33.75,94.75 35.5,96.5 43.91,96.5 45.16,95.25 VT2.2
  Bottom 1.27: R2.1 35.75,90.83 VT3.1 35.02,91.98 33.75,93.25 33.75,94.75
N$3
  Bottom 1.27: 63.24,136.24 R16.4 68.35,141.35 70,143 SA4.1$P
N$4
  Bottom 0.508: IC5.15 26.57,32.83 26.25,32.5 26.25,27.25 28.75,24.75 R21.1
N$5
  Bottom 0.508: R34.2 34.25,15 41.33,7.92 42.19,7.92 HG1.D
N$6
  Bottom 1.27: R3.1 35.25,84.67 38.92,84.67 39.66,85.41 39.66,91.25 VT3.2
N$7
  Bottom 0.508: R33.1 39.75,24.75 37.5,27 37.5,34.25 38.62,35.37 IC3.4
N$8
  Bottom 1.27: R5.1 102,132 99.27,129.27 LED1.A
N$9
  Bottom 1.27: R4.1 118.25,100.92 R7.3
N$10  (via drill 0.8 pad 1.6)
  Top 1.27: v106.25,119.75 v106.25,109.75
  Bottom 1.27: DA1.1 109.04,124.71 112,121.75 112,118.75 111.25,118 107.25,118 106.25,119 v106.25,119.75 | v106.25,109.75 115.75,100.25 115.75,77.5 R7.2
N$11  (via drill 0.8 pad 1.6)
  Top 0.508: v88,88.25 88.25,88 v88.25,71.5
  Top 0.61: v75.25,116.25 v75.25,88.25
  Bottom 0.508: IC1.7 65.89,120.36 67,119.25 67,117.25 68,116.25 70.17,116.25 R17.1
  Bottom 0.61: v75.25,116.25 75.17,116.33 R17.1
  Bottom 1.27: v88,88.25 v75.25,88.25 | v88.25,71.5 100.25,71.5 114.81,56.94 114.81,54.22 113.81,53.22 IC6.27
N$12  (via drill 0.8 pad 1.6)
  Top 1.27: v45,133 v50.5,133
  Bottom 0.508: R54.2 80.5,123.79 80.25,123.54
  Bottom 1.27: VT6.G 80.25,123.54 78.21,123.54 68.75,133 v50.5,133 | R8.1 23.83,124.92 24.75,124 33.25,124 42.25,133 v45,133
N$13
  Bottom 1.27: 88.79,119.71 D3.C 89.54,120.46 | 88.79,119.71 88.25,119.17 88.25,99 85.76,96.51 81.49,96.51 72.24,105.76 R16.3 R16.1 | 88.79,119.71 87.5,121 VT6.D
N$14
  Bottom 1.27: R16.2 60.5,136.25 61.75,137.5 61.75,143.75 61,144.5 55.75,144.5 54.25,143 SA3.1$P
N$15  (via drill 0.8 pad 1.6)
  Top 0.61: v36.25,114 v36.25,106.5
  Bottom 0.508: R6.2 56.82,98.75 40.25,98.75 | 39.71,118.46 VT7.G 40.75,118.71 36.71,118.71 R55.2
  Bottom 0.61: 40.25,98.75 36.25,102.75 v36.25,106.5
  Bottom 1.27: VT7.G 41,117.46 37.54,114 v36.25,114
N$16
  Bottom 0.508: R31.1 45.25,24.5 40.75,29 IC3.1
N$17
  Bottom 0.508: R35.1 31.5,24.75 34.5,27.75 34.5,35.75 38,39.25 40.69,39.25 IC3.7
N$18
  Bottom 0.508: R21.2 28.75,19.33 26.93,17.51 DZ1.1 | DZ1.1
N$19
  Bottom 1.27: LED2.A 23.83,131.9 R12.1
N$20
  Bottom 0.508: 23.88,112.12 24.5,112.75 | 24.5,112.75 25,113.25 | 12.25,118.25 12.25,118 | R13.1 55.75,95.5 53.75,97.5 39.75,97.5 33.75,103.5 24.5,112.75
  Bottom 1.27: VT5.G 9.96,125.54 12.25,123.25 12.25,118.25 | 12.25,118 18.25,112 23.75,112 23.88,112.12 | 23.88,112.12 25,113.25 25,117.52 VT4.1 | 23.88,112.12 25.12,112.12 33.75,103.5
N$21
  Bottom 1.27: R11.1 23,102.91 23.65,102.26 23.65,85.65 8,70 R15.3
N$22
  Bottom 1.27: R14.2 28,116.08 VT4.2
N$23  (via drill 0.8 pad 1.6)
  Top 0.508: v19.25,114 v19.25,103.75
  Bottom 0.508: 19.25,103.5 v19.25,103.75
  Bottom 1.27: R15.2 9.75,75 21.62,86.88 21.62,101.12 19.25,103.5 | v19.25,114 16,117.25 16,134 20.54,138.54 DA2.1
N$25
  Bottom 0.508: IC7.6 6.16,37.91 7.5,39.25 7.5,43 8.83,44.33 R50.2
N$26
  Bottom 0.508: R17.2 68.81,119.17 66.35,121.64 IC1.6 63.62,121.64 63,122.25 63,123.75 63.83,124.58 R18.1
N$27
  Bottom 0.508: R19.2 53.75,122.5 | 53.75,122.5 R20.1 | IC1.2 55.88,120.36 53.75,122.5
N$28  (via drill 0.8 pad 1.6)
  Top 0.508: v41.25,81.75 v41.25,73.25 | v67.25,69.5 v56.5,69.5
  Top 0.61: v48.75,116.25 v48.75,87.75
  Bottom 0.508: IC1.1 57.84,119.09 55.08,116.33 R20.2
  Bottom 0.61: R20.2 48.83,116.33 v48.75,116.25
  Bottom 1.27: v41.25,81.75 41.25,82.75 45.75,87.25 48.25,87.25 v48.75,87.75 | v56.5,69.5 56.38,69.38 44.12,69.38 41.25,72.25 v41.25,73.25 | IC6.28 112.06,56.76 99.32,69.5 v67.25,69.5
N$29
  Bottom 0.508: R22.1 26,24.5 22.59,27.91 IC5.1
N$30
  Bottom 0.508: DZ1.2 24.39,17.47 26,19.08 R22.2
N$31
  Bottom 0.508: IC5.2 22.52,32.75 21,32.75 20.5,32.25 20.5,28 23.25,25.25 R23.2
N$32
  Bottom 0.508: R23.1 23.25,18.83 21.85,17.43 DZ1.3
N$33
  Bottom 0.508: R24.1 20.5,19.08 19.31,17.89 DZ1.4
N$34
  Bottom 0.508: IC5.3 20.84,34.09 19.5,32.75 19.5,26.92 20.5,25.92 R24.2
N$35
  Bottom 0.508: IC3.5 38.38,36.63 36.5,34.75 36.5,25.5 37,25 R38.1
N$36
  Bottom 0.508: IC5.4 20.61,35.37 18.5,33.25 18.5,24.17 R25.2
N$37
  Bottom 0.508: R25.1 17.75,18.83 16.77,17.85 DZ1.5
N$38
  Bottom 0.508: IC5.5 20.39,36.63 17.5,33.75 17.5,27 15,24.5 R26.2 15,23
N$39
  Bottom 0.508: R26.1 15,18.58 14.23,17.81 DZ1.6
N$40
  Bottom 0.508: IC5.6 22.44,37.75 20,37.75 16.5,34.25 16.5,28.67 12.25,24.42 R27.2
N$41
  Bottom 0.508: R27.1 12.25,18.62 11.69,18.06 DZ1.7
N$42
  Bottom 0.508: R28.2 9.5,24.5 15.5,30.5 15.5,34.75 19.93,39.17 IC5.7
N$43
  Bottom 0.508: R28.1 9.15,20.23 DZ1.8
N$44
  Bottom 0.508: R36.1 48,24.5 46.91,25.59 45.84,25.59 43.25,28.17 43.25,32 42.5,32.75 40.84,32.75 IC3.2
N$45
  Bottom 0.508: IC5.14 31.34,34.09 39.25,42 43,42 44.5,40.5 | 44.75,40.5 44.5,40.5 | 44.5,40.5 44.55,40.45 IC3.9
N$46
  Bottom 0.508: IC7.7 5.75,39.17 6.25,39.67 6.25,42.08 5.25,43.08 R51.1
N$47
  Bottom 0.508: IC7.14 13.35,34.09 21.25,42 24.75,42 26.3,40.45 IC5.9
N$48
  Bottom 0.508: IC7.15 9.07,32.83 6.75,30.5 R29.2
N$49
  Bottom 0.508: IC7.1 4.43,23.85 R30.1
N$50
  Bottom 0.508: DZ1.10 4.07,20.56 4.05,20.58 R30.2
N$51
  Bottom 0.508: R29.1 6.61,20.44 DZ1.9
N$52
  Bottom 0.508: HG1.A 45.25,18.64 R31.2
N$53
  Bottom 0.508: R32.2 50.75,19.68 HG1.B
N$54
  Bottom 0.508: R33.2 39.75,19.58 37.5,17.33 37.5,15.75 43.25,10 45.19,10 HG1.C
N$55
  Bottom 0.508: R50.1 10,48.98 LED3.A
N$56
  Bottom 0.508: R35.2 31.5,15 39.83,6.67 HG1.E
N$57
  Bottom 0.508: R36.2 48,18.85 HG1.F
N$58
  Bottom 0.508: R37.2 42.5,19.33 41.75,18.58 40.5,18.58 39,17.08 39,16.25 44.25,11 46.73,11 HG1.G
N$59
  Bottom 0.508: R38.2 37,19.08 36.48,18.56 36.48,14.92 42.48,8.92 43.73,8.92 HG1.DP
N$60
  Bottom 1.27: XS2.2 58,141 55.5,141 51.25,136.75 49.75,136.75 47.75,134.75 47.75,131.5 46.12,129.88 42.09,129.88 39.79,127.58 39.83,127.58 37.25,125 37.25,121.92 | 41,121.04 VT7.D 38.17,121 37.25,121.92 | 37.25,121.92 D4.C
N$61
  Bottom 0.508: R32.1 50.75,24.42 48.5,26.67 46.25,26.67 44.75,28.17 44.75,32.08 45.5,32.83 IC3.15
N$62
  Bottom 2.54: F1.1 17.29,89.46 14.75,92 J1.1
N$63
  Bottom 1.27: 64.5,146.5 65.5,145.5 SA4.1$S | 64.5,146.5 54.5,146.5 53.5,145.5 SA3.1$S | XS2.1 64.5,146.5
N$64
  Bottom 0.508: IC3.3 39.34,34.09 38.5,33.25 38.5,28.75 42.5,24.75 R37.1
N$65
  Bottom 2.54: F1.2 17.75,95.79 13.96,95.79 12,97.75 12,103 13.5,104.5 SA5.2
N$67
  Bottom 0.508: IC3.6 38.16,37.91 35.5,35.25 35.5,25.75 34.25,24.5 R34.1
N$68
  Bottom 0.508: LED4.A 5.25,49.73 R51.2
N$69
  Bottom 0.508: IC4.15 63.58,32.83 61.75,31 R39.1
N$70
  Bottom 0.508: R40.1 59,31.48 IC4.1
N$71
  Bottom 0.508: R41.1 56.25,31.75 57.33,32.83 IC4.2
N$72
  Bottom 0.508: R42.1 53.5,31.25 56.34,34.09 IC4.3
N$73  (via drill 0.8 pad 1.6)
  Top 0.508: v58.5,22.75 v58.5,12.54
  Bottom 0.508: v58.5,22.75 56.25,25 R41.2 | R43.1 58.5,10.33 v58.5,12.54 62.96,12.54 64.74,10.76 VT8.2
N$74  (via drill 0.8 pad 1.6)
  Top 0.508: v61,22.75 v61,18
  Bottom 0.508: VT9.2 67.88,16.18 64.07,16.18 62.25,18 v61,18 59.25,18 58.58,17.33 R44.1 | R40.2 59,24.75 v61,22.75
N$75  (via drill 0.8 pad 1.6)
  Top 0.508: v63.45,22.8 63.45,20.68 64.38,19.75 v64.5,19.75
  Bottom 0.508: R45.1 64.66,25.58 R39.2 61.75,24.5 v63.45,22.8 | VT10.2 66.78,19.75 v64.5,19.75
N$76  (via drill 0.8 pad 1.6)
  Top 0.508: v56,6.75 v56,22.75
  Bottom 0.508: VT11.2 64.66,5.59 63,7.25 58.83,7.25 58.58,7 R46.1 56.78,5.5 56,6.71 v56,6.75 | v56,22.75 53.5,25.25 R42.2
N$77
  Bottom 0.508: HG1.A1 44.98,12.75 56,12.75 57.25,14 63.27,14 64.61,12.67 VT8.1
N$78
  Bottom 0.508: HG1.A2 48.52,16.75 51.27,14 55.5,14 56.38,14.88 56.38,17.88 58,19.5 62.5,19.5 64.17,17.83 VT9.1
N$79
  Bottom 0.508: VT10.1 65.86,23 63.68,20.82 57.75,20.82 55.25,18.32 55.25,15.75 54.75,15.25 52.31,15.25 51.06,16.5 HG1.A3
N$80
  Bottom 0.508: VT11.1 64.61,7.5 63.69,8.42 54.6,8.42 53.6,7.42 HG1.A4
N$81
  Bottom 0.508: Q1.2 96.48,34.68 C7.2
  Bottom 1.27: IC6.9 99.78,35.44 Q1.2
N$82
  Bottom 0.508: C9.2 96.48,41.25 95,39.77 95,31.34 Q1.1
  Bottom 1.27: IC6.10 102.06,32.9 Q1.1
N$83
  Bottom 1.27: IC6.21 117.75,37.98 119.02,39.25 C10.1
N$84
  Bottom 1.27: L1.2 111.83,35.67 IC6.20 115.54,35.44 C12.1
N$85  (via drill 0.8 pad 1.6)
  Top 0.508: v81,36.25 v90.75,36.25
  Bottom 1.27: IC6.1 92.44,55.76 90.75,54.07 v90.75,36.25 | JP1.4 90.48,14.69 80.67,24.5 R47.2 80.67,35.92 v81,36.25
N$86
  Bottom 0.508: 107.82,58.25 106.76,58.24 | 106.76,58.24 107.75,58.25 108,58 | 106.76,58.24 106.26,58.24 99.75,58.2 SA6.P$1 SA6.P$2 89.42,61.53 R52.2 | 99.03,67.03 98.82,67.25 C14.1
  Bottom 1.27: SA6.P$2 99.75,58.2 | SA6.P$1 107.8,58.2 108,58 108,49.25 106.89,48.14 IC6.4 | 99.03,67.03 107.82,58.25
N$87
  Bottom 0.508: 114.49,9.79 R53.2
  Bottom 1.27: R48.1 114.46,9.75 114.49,9.79
N$88
  Bottom 0.508: R48.2 110,7.25 109,8.25 109,10.5 118.75,20.25 118.75,31 121.75,34 121.75,43.75 119.5,46 116.5,46 113.56,43.06 IC6.23
PWM  (via drill 0.8 pad 1.6)
  Top 0.508: v83.25,45.75 v83.25,42.25 | v67.75,52 v61.5,52
  Bottom 0.508: IC6.15 110.56,22.74 110.03,22.21 110.03,19.54 108.25,17.75 97,17.75 85.25,29.5 85.25,40.25 v83.25,42.25 | v83.25,45.75 81.25,45.75 78,49 71,49 68,52 v67.75,52
  Bottom 1.27: v61.5,52 43.7,52 SA1.1$O
PWM-CTRL  (via drill 0.8 pad 1.6)
  Top 1.27: v61.75,55.5 v67.75,55.5 | v94.75,52 v83.5,52
  Bottom 1.27: 56.85,59 56.85,58.75 58.75,58.75 61.75,55.75 v61.75,55.5 | 56.85,59 C13.1 | v67.75,55.5 71.25,52 v83.5,52 | v94.75,52 94.75,52.61 95.57,53.43 100.19,53.43 102.94,50.68 IC6.3 | SA2.1$P 24.5,56.75 26.75,59 SA1.1$S 56.85,59
RIGHT-EN
  Bottom 1.27: R49.1 24.75,62 22,59.25 SA2.1$O
VCC  (via drill 0.8 pad 1.6)
  Top 0.508: v28.75,28.5 v10.25,28.5 | v32.25,28.5 v47,28.5 | v67.25,28.5 v50.75,28.5 | v30.75,49.5 v30.75,42.5 | v49.5,42.5 v49.5,49.5 | v67.75,42.5 v67.75,49.5 | v13.5,31.5 v13.5,42.25 | v83.25,93 83,92.75 v83,64.5
  Bottom 0.508: 64.85,116.9 67.5,114.25 75.5,114.25 86.5,103.25 86.5,99.75 85.25,98.5 82.5,98.5 73,108 54.75,108 53.75,107 53.75,105 55,103.75 60.75,103.75 64.25,100.25 64.25,98.25 65.5,97 69.04,97 69.15,96.9 | 10.57,28.82 v10.25,28.5 13.3,31.55 | v28.75,28.5 v28.74,28.51 IC5.16 | IC7.10 12.18,39.17 13.5,40.5 v13.5,42.25 | IC5.10 30,39.17 30.75,39.92 v30.75,42.5 | IC3.10 48.67,39.17 49.5,40 v49.5,42.5 | v47,28.5 46.91,28.59 IC3.16 | v67.25,28.5 65.07,30.68 IC4.16 | IC4.10 66.67,39.17 67.75,40.25 v67.75,42.5 | VT11.3 69.39,7.42 | IC7.16 13.3,31.55 | v13.5,31.5 13.45,31.55 13.3,31.55 | VT11.3 69.89,7 69.89,4.75 69.3,4.16 64.41,4.16 63.06,5.5 R46.2 | R43.2 63.5,10.25 64.25,9.5 67.39,9.5 VT11.3 | R44.2 62.75,15.75 63.5,15 64.75,15 65.5,14.25 68,14.25 69.39,12.86 VT8.3 | R45.2 70.25,25.75 | v83,64.5 82.25,65.25 64.54,65.25 | 106.71,40.79 106.44,40.52 | R48.3 110.75,5.25 92.19,5.25 87.94,9.5 JP1.5 | v83,64.5 83.25,64.5 | R52.1 v83,64.5
  Bottom 0.61: IC1.8 64.85,116.9
  Bottom 1.27: U$3.3 64.54,72.75 63.29,71.5 63.29,66.75 63.27,66.75 C11.+ 63.27,66.5 64.54,65.23 | 64.54,62.04 64.54,49.71 64.75,49.5 v67.75,49.5 v49.5,49.5 49.42,49.5 49.34,49.59 30.84,49.59 v30.75,49.5 20.75,49.5 v13.5,42.25 | 64.54,62.04 64.54,64.5 64.54,65.23 | 64.54,65.23 64.54,65.25 | v13.5,31.5 13.5,31 11,28.5 v10.25,28.5 | v28.75,28.5 v32.25,28.5 | v47,28.5 v50.75,28.5 | v67.25,28.5 68.5,28.5 70.25,26.75 70.25,25.75 70.25,23.75 69.5,23 VT10.3 70.25,22.14 70.25,18.5 69.58,17.83 VT9.3 69.92,17.83 70.25,17.5 70.25,16.75 | VT11.3 70.25,8.36 70.25,12.25 | 70.25,12.25 70.25,13.52 | 70.25,12.25 69.83,12.67 VT8.3 70.25,13.52 | 70.25,13.52 70.25,16.75 | L1.1 108.5,42.58 106.71,40.79 | 106.44,40.52 IC6.7 102.23,40.52 101.25,41.5 101.25,49.5 99.75,51 97.5,51 96.5,50 96.5,49 | R49.2 64.54,62.04 | 96.5,49 C6.+ | R47.1 90.83,34 | 96.5,49 96.5,44.77 C8.1 95.5,44.75 93.25,42.5 93.25,35.25 92,34 90.83,34 | v83,64.5 83,63.75 88.25,58.5 88.25,35.25 89.5,34 90.83,34 | JP1.5 87.94,13.5 84.69,16.75 70.25,16.75 | v83.25,93 73.04,93 69.15,96.9
  pour Bottom: 70.25,16.5 85.5,16.5 78.75,23.25 78.75,38.75 77.25,40.25 76,40.25 67.25,31.5 67.25,28.5 68.25,28.5 70,26.75 70,17 70.25,16.75
  pour Bottom: 64.75,65.25 82.25,65.25 90.88,56.62 88.5,54.25 72.5,54.25 68.75,58 64.75,58
VI-LEFT
  Bottom 0.508: C1.1 91.35,143.6 85.25,137.5 85.25,134.25 89.75,129.75 94.25,129.75 95.75,131.25 98.5,131.25 101.25,134 103.5,134 104.75,132.75 104.75,131 90,116.25 90,98.25 86.5,94.75 79.38,94.75
  Bottom 1.27: DA1.3 104.34,141.38 104.34,143.34 104.6,143.6 | C1.1 104.6,143.6 | VT1.D 114.25,123 113,124.25 113,131.92 R5.2 113.25,132 113.25,142.75 111.25,144.75 105.75,144.75 104.6,143.6 | R6.1 75.18,98.95 79.38,94.75
VI-RIGHT
  Bottom 1.27: VT5.D 6,123 5.5,123.5 5.5,127.75 9.75,132 11.25,132 | 11.25,132 R12.2 R8.2 | DA2.3 15.36,141.1 C4.1 11.25,132
VO-LEFT
  Bottom 0.508: D3.A 94.08,132.08 95,133 97.5,133 99.75,135.25 104.5,135.25 106,133.75 106,123.33 R4.2
  Bottom 1.27: DA1.2 106.5,138.25 105.25,137 102,137 98.5,140.5 92.29,140.5 C2.+ 90,133.79 90,133.08 D3.A
  pour Bottom: 106,130 91.5,115.5 91.5,109.25 104.5,122.25 107,122.25 106,123.25
VO-RIGHT
  Bottom 1.27: DA2.2 18,143 19.25,144.25 29.21,144.25 C3.+ 35,135.04 D4.A 28.17,132.08 26,134.25 20,134.25 18.25,132.5 18.25,118.83 R11.2

### Text on the board
Bottom: DRAGBERRY / 2020 | GALVANIKA | CUPRUMBERRY